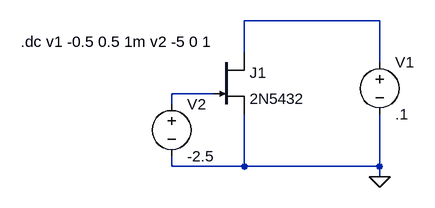
[diagram p0: schematic jfet_Rds.asc]
jfet_Rds.asc, the LTspice schematic file:
Version 4
SHEET 1 880 680
WIRE 432 48 224 48
WIRE 224 96 224 48
WIRE 432 112 432 48
WIRE 176 160 112 160
WIRE 112 176 112 160
WIRE 112 272 112 256
WIRE 224 272 224 192
WIRE 224 272 112 272
WIRE 432 272 432 192
WIRE 432 272 224 272
WIRE 432 288 432 272
FLAG 432 288 0
SYMBOL njf 176 96 R0
SYMATTR InstName J1
SYMATTR Value 2N5432
SYMBOL voltage 432 96 R0
WINDOW 123 0 0 Left 0
WINDOW 39 0 0 Left 0
SYMATTR InstName V1
SYMATTR Value .1
SYMBOL voltage 112 160 R0
WINDOW 123 0 0 Left 0
WINDOW 39 0 0 Left 0
SYMATTR InstName V2
SYMATTR Value -2.5
TEXT -120 80 Left 2 !.dc v1 -0.5 0.5 1m v2 -5 0 1

The netlist it stands for:
* jfet_Rds.asc
J1 N001 N002 0 2N5432
V1 N001 0 .1
V2 N002 0 -2.5
.model NJF NJF
.model PJF PJF
.lib standard.jft
.dc v1 -0.5 0.5 1m v2 -5 0 1
.backanno
.end